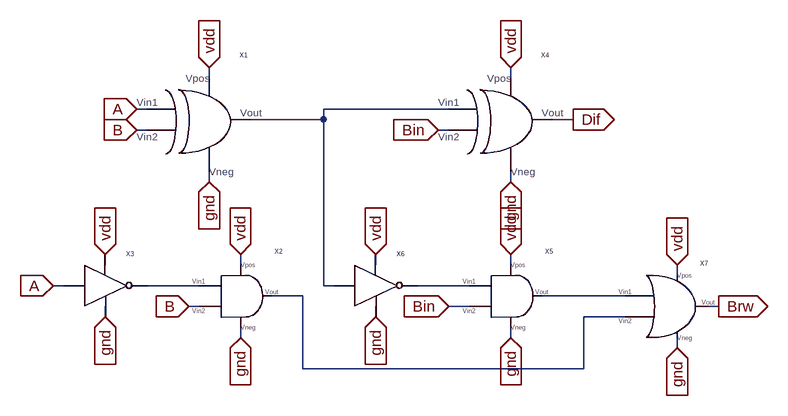
[diagram p0: schematic fsub.asc]
fsub.asc, the LTspice schematic file:
Version 4
SHEET 1 880 680
WIRE -256 -112 -256 -128
WIRE 208 -112 208 -128
WIRE -352 -64 -368 -64
WIRE 112 -64 -80 -64
WIRE -80 -48 -80 -64
WIRE -80 -48 -192 -48
WIRE 304 -48 272 -48
WIRE -352 -32 -368 -32
WIRE 112 -32 96 -32
WIRE -256 48 -256 32
WIRE 208 48 208 32
WIRE -416 176 -416 160
WIRE -208 176 -208 160
WIRE 0 176 0 160
WIRE 208 176 208 160
WIRE 464 192 464 176
WIRE -480 208 -496 208
WIRE -272 208 -352 208
WIRE -80 208 -80 -48
WIRE -64 208 -80 208
WIRE 144 208 64 208
WIRE -112 224 -160 224
WIRE 384 224 256 224
WIRE -272 240 -288 240
WIRE 144 240 112 240
WIRE 528 240 512 240
WIRE -416 256 -416 240
WIRE 0 256 0 240
WIRE 384 256 320 256
WIRE -208 288 -208 272
WIRE 208 288 208 272
WIRE 464 304 464 288
WIRE -112 336 -112 224
WIRE 320 336 320 256
WIRE 320 336 -112 336
FLAG -368 -64 A
IOPIN -368 -64 In
FLAG -496 208 A
IOPIN -496 208 In
FLAG -368 -32 B
IOPIN -368 -32 In
FLAG -288 240 B
IOPIN -288 240 In
FLAG -256 -128 vdd
IOPIN -256 -128 In
FLAG -208 160 vdd
IOPIN -208 160 In
FLAG -416 160 vdd
IOPIN -416 160 In
FLAG 208 -128 vdd
IOPIN 208 -128 In
FLAG 208 160 vdd
IOPIN 208 160 In
FLAG 0 160 vdd
IOPIN 0 160 In
FLAG 304 -48 Dif
IOPIN 304 -48 Out
FLAG 96 -32 Bin
IOPIN 96 -32 In
FLAG 112 240 Bin
IOPIN 112 240 In
FLAG 464 176 vdd
IOPIN 464 176 In
FLAG 528 240 Brw
IOPIN 528 240 Out
FLAG 208 48 gnd
IOPIN 208 48 In
FLAG 464 304 gnd
IOPIN 464 304 In
FLAG 208 288 gnd
IOPIN 208 288 In
FLAG 0 256 gnd
IOPIN 0 256 In
FLAG -208 288 gnd
IOPIN -208 288 In
FLAG -416 256 gnd
IOPIN -416 256 In
FLAG -256 48 gnd
IOPIN -256 48 In
SYMBOL xor -208 -64 R0
SYMATTR InstName X1
SYMBOL and -176 224 R0
SYMATTR InstName X2
SYMBOL inverter -416 224 R0
SYMATTR InstName X3
SYMBOL xor 256 -64 R0
SYMATTR InstName X4
SYMBOL and 240 224 R0
SYMATTR InstName X5
SYMBOL inverter 0 224 R0
SYMATTR InstName X6
SYMBOL or 208 240 R0
SYMATTR InstName X7

The netlist it stands for:
* fsub.asc
XX1 A B vdd gnd N001 xor  ; pins A B vdd gnd Y
XX2 vdd N002 B gnd N004 and  ; pins vdd A B gnd Y
XX3 N002 vdd A gnd inverter  ; pins Y vdd A gnd
XX4 N001 Bin vdd gnd Dif xor  ; pins A B vdd gnd Y
XX5 vdd N003 Bin gnd N005 and  ; pins vdd A B gnd Y
XX6 N003 vdd N001 gnd inverter  ; pins Y vdd A gnd
XX7 vdd N005 N004 gnd Brw or  ; pins vdd A B gnd Y
.backanno
.end